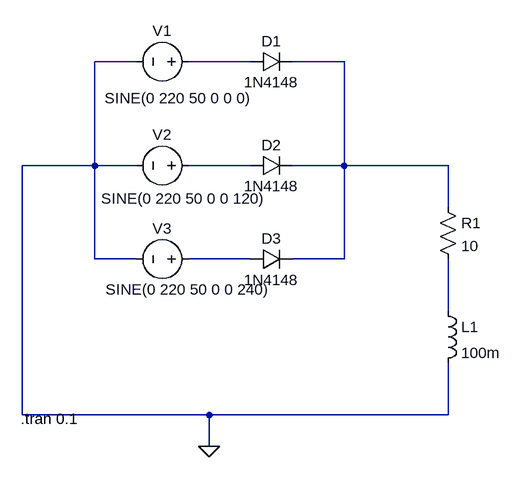
[diagram p0: schematic 3 Phase HWR-RL.asc]
3 Phase HWR-RL.asc, the LTspice schematic file:
Version 4
SHEET 1 880 692
WIRE -64 80 -128 80
WIRE 112 80 16 80
WIRE 256 80 176 80
WIRE -128 240 -128 80
WIRE -128 240 -240 240
WIRE -64 240 -128 240
WIRE 112 240 16 240
WIRE 256 240 256 80
WIRE 256 240 176 240
WIRE 416 240 256 240
WIRE 416 304 416 240
WIRE -128 384 -128 240
WIRE -64 384 -128 384
WIRE 112 384 16 384
WIRE 256 384 256 240
WIRE 256 384 176 384
WIRE 416 464 416 384
WIRE -240 624 -240 240
WIRE 48 624 -240 624
WIRE 416 624 416 544
WIRE 416 624 48 624
WIRE 48 672 48 624
FLAG 48 672 0
SYMBOL voltage 32 80 R90
WINDOW 0 -32 56 VBottom 2
WINDOW 3 40 31 VTop 2
WINDOW 123 0 0 Left 0
WINDOW 39 0 0 Left 0
SYMATTR InstName V1
SYMATTR Value SINE(0 220 50 0 0 0)
SYMBOL voltage 32 240 R90
WINDOW 0 -32 56 VBottom 2
WINDOW 3 35 23 VTop 2
WINDOW 123 0 0 Left 0
WINDOW 39 0 0 Left 0
SYMATTR InstName V2
SYMATTR Value SINE(0 220 50 0 0 120)
SYMBOL voltage 32 384 R90
WINDOW 0 -32 56 VBottom 2
WINDOW 3 31 16 VTop 2
WINDOW 123 0 0 Left 0
WINDOW 39 0 0 Left 0
SYMATTR InstName V3
SYMATTR Value SINE(0 220 50 0 0 240)
SYMBOL diode 112 96 R270
WINDOW 0 32 32 VTop 2
WINDOW 3 0 32 VBottom 2
SYMATTR InstName D1
SYMATTR Value 1N4148
SYMBOL diode 112 256 R270
WINDOW 0 32 32 VTop 2
WINDOW 3 0 32 VBottom 2
SYMATTR InstName D2
SYMATTR Value 1N4148
SYMBOL diode 112 400 R270
WINDOW 0 32 32 VTop 2
WINDOW 3 0 32 VBottom 2
SYMATTR InstName D3
SYMATTR Value 1N4148
SYMBOL res 400 288 R0
SYMATTR InstName R1
SYMATTR Value 10
SYMBOL ind 400 448 R0
SYMATTR InstName L1
SYMATTR Value 100m
TEXT -242 630 Left 2 !.tran 0.1

The netlist it stands for:
* 3 Phase HWR-RL.asc
V1 N001 0 SINE(0 220 50 0 0 0)
V2 N003 0 SINE(0 220 50 0 0 120)
V3 N004 0 SINE(0 220 50 0 0 240)
D1 N001 N002 1N4148
D2 N003 N002 1N4148
D3 N004 N002 1N4148
R1 N002 N005 10
L1 N005 0 100m
.model D D
.lib standard.dio
.tran 0.1
.backanno
.end